# EAGLE schematic activity_monitor_v1.3 (EAGLE 6.4)
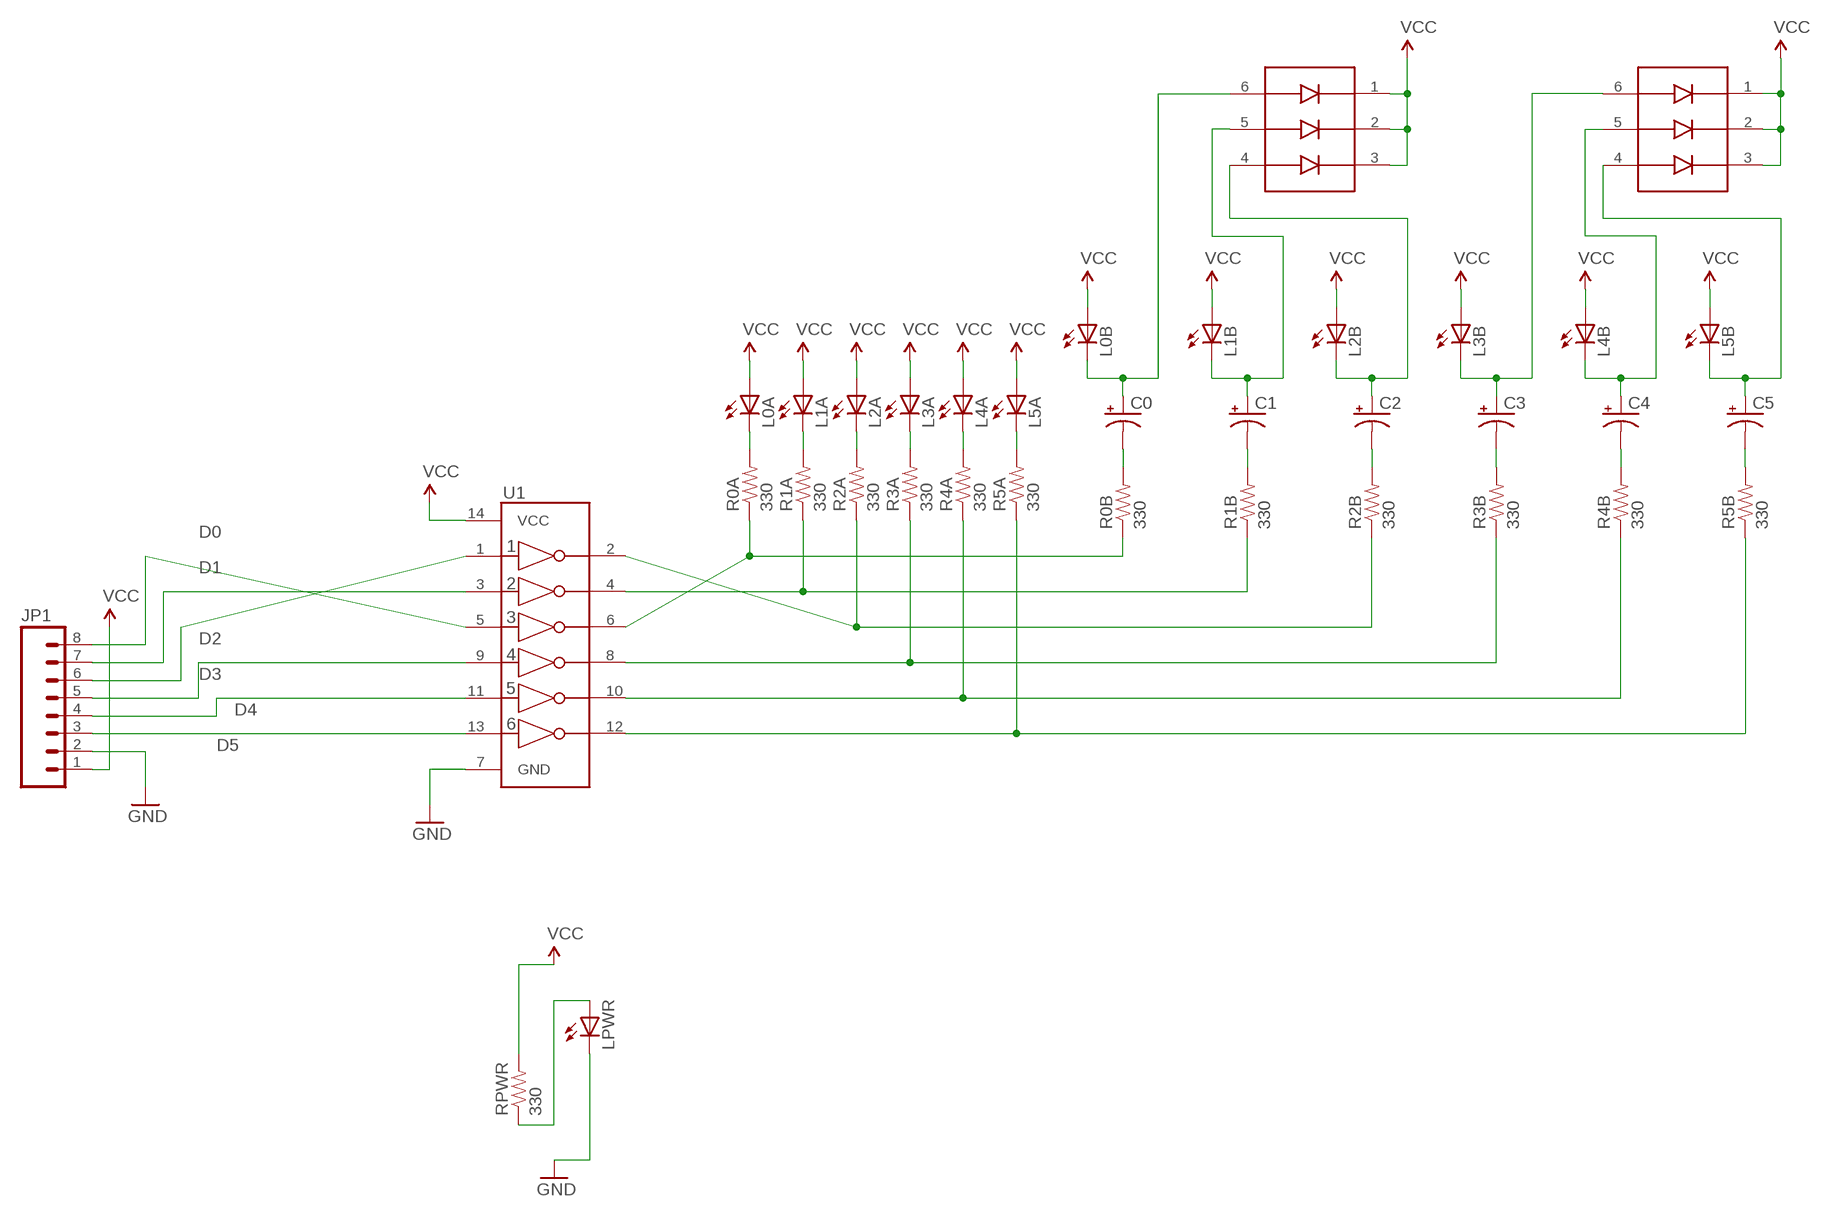
[diagram p0: schematic, sheet 1]

## Parts
C0  10UF-TANT  [EIA3216]
C1  10UF-TANT  [EIA3216]
C2  10UF-TANT  [EIA3216]
C3  10UF-TANT  [EIA3216]
C4  10UF-TANT  [EIA3216]
C5  10UF-TANT  [EIA3216]
JP1  M081X08  [1X08]
L0A  LED0603  [0603_LED]
L0B  LED0603  [0603_LED]
L1A  LED0603  [0603_LED]
L1B  LED0603  [0603_LED]
L2A  LED0603  [0603_LED]
L2B  LED0603  [0603_LED]
L3A  LED0603  [0603_LED]
L3B  LED0603  [0603_LED]
L4A  LED0603  [0603_LED]
L4B  LED0603  [0603_LED]
L5A  LED0603  [0603_LED]
L5B  LED0603  [0603_LED]
LPWR  LED0603  [0603_LED]
R0A  330  RESISTOR0603  [0603-RES]
R0B  330  RESISTOR0603  [0603-RES]
R1A  330  RESISTOR0603  [0603-RES]
R1B  330  RESISTOR0603  [0603-RES]
R2A  330  RESISTOR0603  [0603-RES]
R2B  330  RESISTOR0603  [0603-RES]
R3A  330  RESISTOR0603  [0603-RES]
R3B  330  RESISTOR0603  [0603-RES]
R4A  330  RESISTOR0603  [0603-RES]
R4B  330  RESISTOR0603  [0603-RES]
R5A  330  RESISTOR0603  [0603-RES]
R5B  330  RESISTOR0603  [0603-RES]
RPWR  330  RESISTOR0603  [0603-RES]
U1  74HC04_HEX_INVERTERTSSOP14  [TSSOP14]
U$1  SD103ATW-7-F  [SOT363]
U$2  SD103ATW-7-F  [SOT363]

## Nets
D0: JP1.8 U1.5(3A)
D1: JP1.7 U1.3(2A)
D2: JP1.6 U1.1(1A)
D3: JP1.5 U1.9(4A)
D4: JP1.4 U1.11(5A)
D5: JP1.3 U1.13(6A)
GND: JP1.2 LPWR.C U1.7(GND)
N$1: R0A.1 R0B.1 U1.6(3Y)
N$2: R1A.1 R1B.1 U1.4(2Y)
N$3: C5.C(-) R5B.2
N$4: C4.C(-) R4B.2
N$5: L0A.C R0A.2
N$6: L1A.C R1A.2
N$7: L2A.C R2A.2
N$8: L3A.C R3A.2
N$9: C3.C(-) R3B.2
N$10: C0.A(+) L0B.C U$1.6(I1)
N$11: L4A.C R4A.2
N$12: C2.C(-) R2B.2
N$13: LPWR.A RPWR.1
N$14: L5A.C R5A.2
N$15: C1.C(-) R1B.2
N$16: R2A.1 R2B.1 U1.2(1Y)
N$17: R3A.1 R3B.1 U1.8(4Y)
N$18: C0.C(-) R0B.2
N$19: R4A.1 R4B.1 U1.10(5Y)
N$20: R5A.1 R5B.1 U1.12(6Y)
N$27: C1.A(+) L1B.C U$1.5(I2)
N$28: C2.A(+) L2B.C U$1.4(I3)
N$29: C3.A(+) L3B.C U$2.6(I1)
N$30: C4.A(+) L4B.C U$2.5(I2)
N$31: C5.A(+) L5B.C U$2.4(I3)
VCC: JP1.1 L0A.A L0B.A L1A.A L1B.A L2A.A L2B.A L3A.A L3B.A L4A.A L4B.A L5A.A L5B.A RPWR.2 U1.14(VCC) U$1.1(O1) U$1.2(O2) U$1.3(O3) U$2.1(O1) U$2.2(O2) U$2.3(O3)

## Library data of the parts
C0 C1-C5 = SparkFun-Capacitors:10UF-TANT: 10uF Tantalum SMT CAP-00811- 16V 10% (EIA-3216); PROD_ID: CAP-00811; VALUE: 10uF
JP1 = SparkFun-Connectors:M08: Header 8 Standard 8-pin 0.1" header. Use with straight break away headers (SKU : PRT-00116), right angle break away headers (PRT-00553), swiss pins (PRT-00743), machine pins (PRT-00117), and female headers (PRT-00115).
L0A L0B L1A L1B L2A L2B L3A L3B L4A L4B L5A L5B LPWR = kmod:LED
R0A R0B R1A R1B R2A R2B R3A R3B R4A R4B R5A R5B RPWR = kmod:RESISTOR: Resistor Basic schematic elements and footprints for 0603, 1206, and PTH resistors.
U1 = kmod:74HC04_HEX_INVERTER: 74HC04 Hex Inverter
U$1 U$2 = kmod:SD103ATW-7-F: Diode array: 3x

## Net classes
0 default: width 0.152 mm, clearance 0.152 mm